# EAGLE schematic science_controller (EAGLE 9.3.0)

## Sheet 1 of 3: MCU / Power
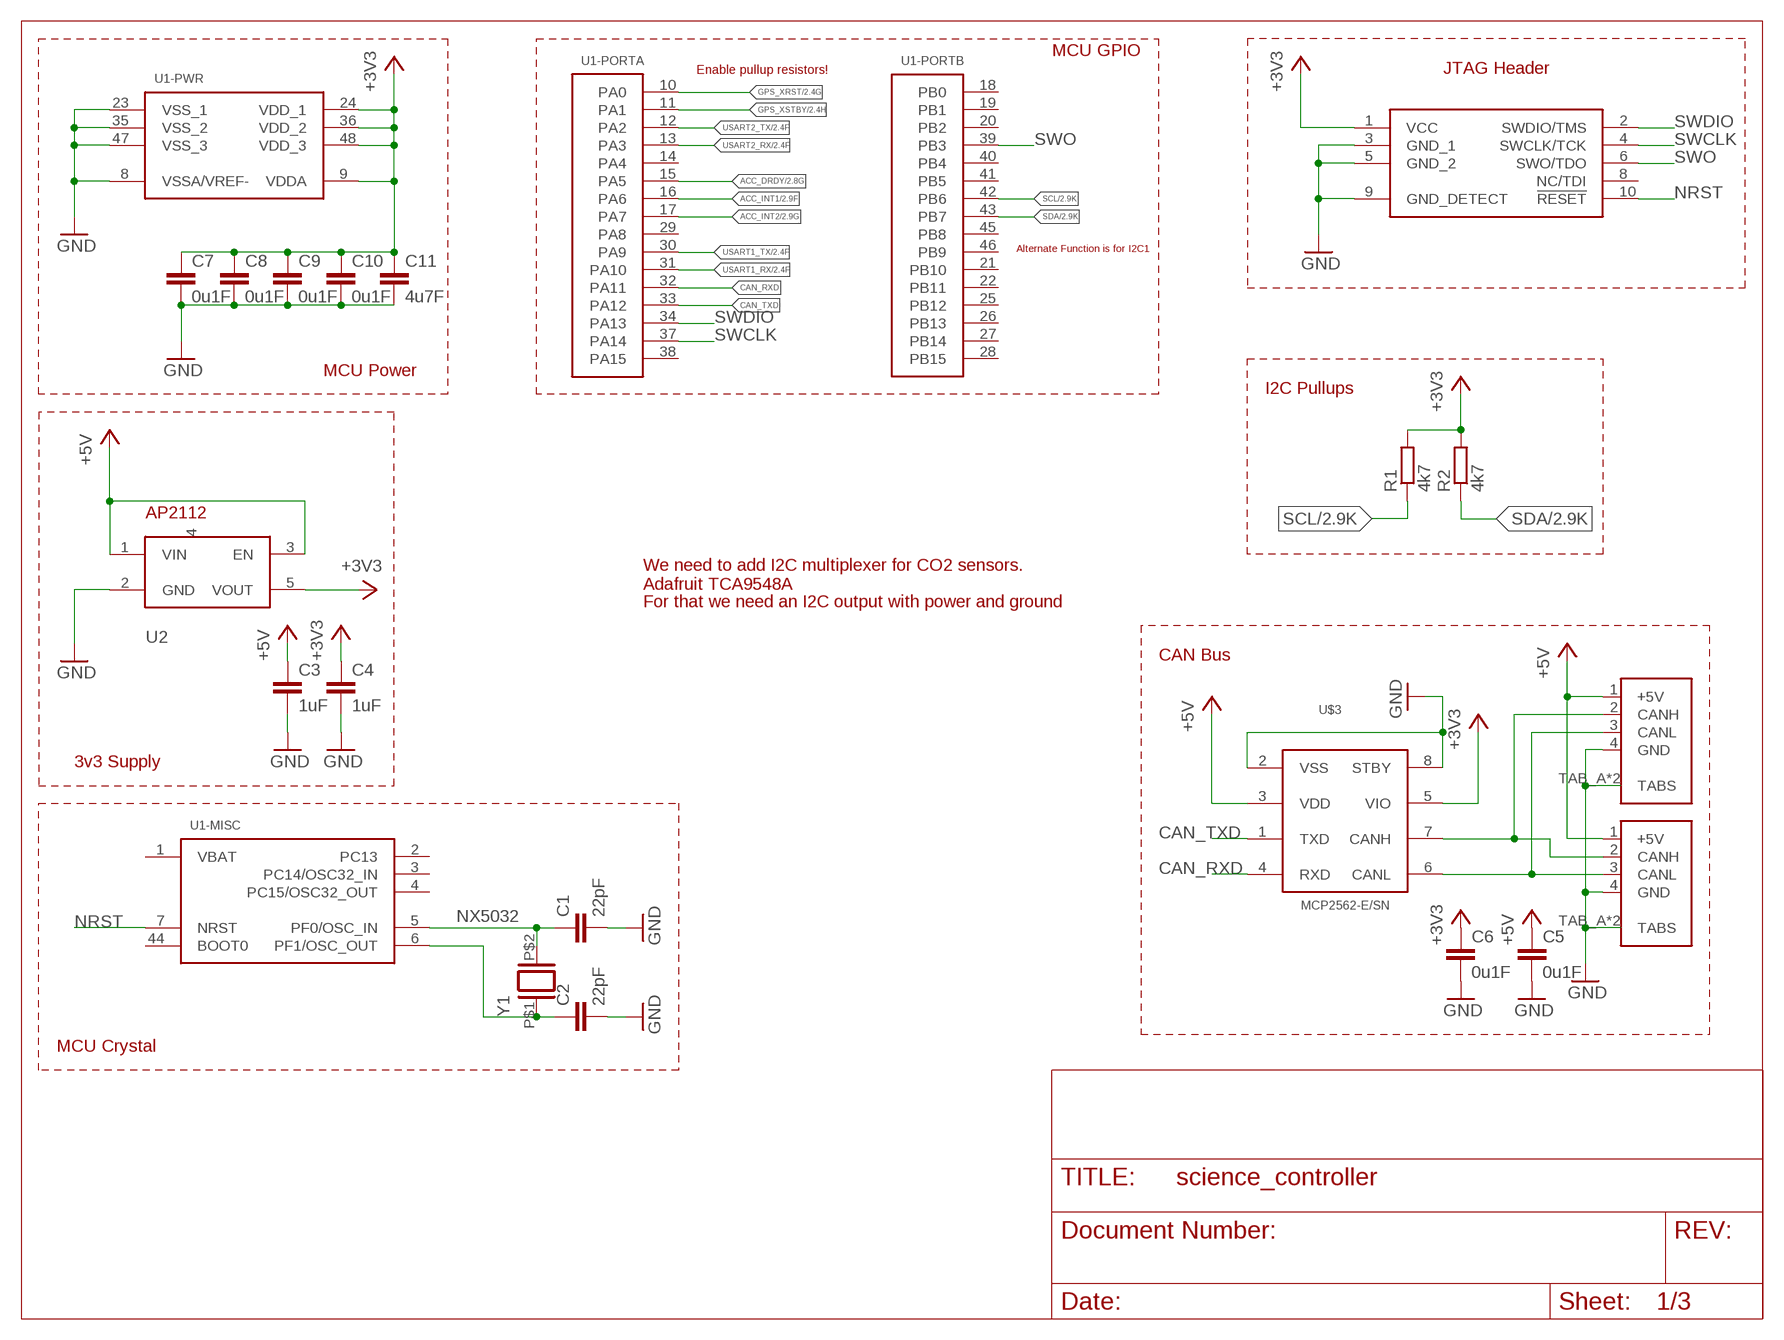
[diagram p0: schematic, sheet 1]

### Parts
C1  22pF  C-EUC0805  [C0805]
C2  22pF  C-EUC0805  [C0805]
C3  1uF  C-EUC0805  [C0805]
C4  1uF  C-EUC0805  [C0805]
C5  0u1F  C-EUC0805  [C0805]
C6  0u1F  C-EUC0805  [C0805]
C7  0u1F  C-EUC0805  [C0805]
C8  0u1F  C-EUC0805  [C0805]
C9  0u1F  C-EUC0805  [C0805]
C10  0u1F  C-EUC0805  [C0805]
C11  4u7F  C-EUC0805  [C0805]
CON1  UAVCAN_MICRO  [SM04B-GHS-TB]
CON2  UAVCAN_MICRO  [SM04B-GHS-TB]
JP1  CORTEX-M-DBG  [FTSH-105-01-F-DV-007]
R1  4k7  R-EU_R0805  [R0805]
R2  4k7  R-EU_R0805  [R0805]
U1  STM32F303CB  [LQFP48]
U2  AP2112K-3.3TRG1  [SOT25]
U$3  MCP2562-E/SN  [SOIC8]
Y1  NX5032  [NX5032]

### Nets
+3V3: C4.1 C6.1 C7.1 C8.1 C9.1 C10.1 C11.1 JP1.1(VCC) R1.2 R2.2 U1.9(-PWR:VDDA) U1.24(-PWR:VDD_1) U1.36(-PWR:VDD_2) U1.48(-PWR:VDD_3) U2.5(VOUT) U$3.5(VIO) ; also sheet 2
+5V: C3.1 C5.1 CON1.1(+5V) CON2.1(+5V) U2.1(VIN) U2.3(EN) U$3.3(VDD) ; also sheet 2,3
ACC_DRDY: U1.15(-PORTA:PA5) ; also sheet 2
ACC_INT1: U1.16(-PORTA:PA6) ; also sheet 2
ACC_INT2: U1.17(-PORTA:PA7) ; also sheet 2
CAN_RXD: U1.32(-PORTA:PA11) U$3.4(RXD)
CAN_TXD: U1.33(-PORTA:PA12) U$3.1(TXD)
GND: C1.2 C2.2 C3.2 C4.2 C5.2 C6.2 C7.2 C8.2 C9.2 C10.2 C11.2 CON1.4(GND) CON1.TAB_A(TABS) CON1.TAB_B(TABS) CON2.4(GND) CON2.TAB_A(TABS) CON2.TAB_B(TABS) JP1.3(GND_1) JP1.5(GND_2) JP1.9(GND_DETECT) U1.8(-PWR:VSSA/VREF-) U1.23(-PWR:VSS_1) U1.35(-PWR:VSS_2) U1.47(-PWR:VSS_3) U2.2(GND) U$3.2(VSS) U$3.8(STBY) ; also sheet 2,3
GPS_XRST: U1.10(-PORTA:PA0) ; also sheet 2
GPS_XSTBY: U1.11(-PORTA:PA1) ; also sheet 2
N$1: C1.1 U1.5(-MISC:PF0/OSC_IN) Y1.P$2
N$2: C2.1 U1.6(-MISC:PF1/OSC_OUT) Y1.P$1
N$3: CON1.2(CANH) CON2.2(CANH) U$3.7(CANH)
N$4: CON1.3(CANL) CON2.3(CANL) U$3.6(CANL)
NRST: JP1.10(!RESET) U1.7(-MISC:NRST)
SCL: R1.1 U1.42(-PORTB:PB6) ; also sheet 2,3
SDA: R2.1 U1.43(-PORTB:PB7) ; also sheet 2,3
SWCLK: JP1.4(SWCLK/TCK) U1.37(-PORTA:PA14)
SWDIO: JP1.2(SWDIO/TMS) U1.34(-PORTA:PA13)
SWO: JP1.6(SWO/TDO) U1.39(-PORTB:PB3)
USART1_RX: U1.31(-PORTA:PA10) ; also sheet 2
USART1_TX: U1.30(-PORTA:PA9) ; also sheet 2
USART2_RX: U1.13(-PORTA:PA3) ; also sheet 2
USART2_TX: U1.12(-PORTA:PA2) ; also sheet 2
Unconnected: JP1.8(NC/TDI) U1.1(-MISC:VBAT) U1.2(-MISC:PC13) U1.3(-MISC:PC14/OSC32_IN) U1.4(-MISC:PC15/OSC32_OUT) U1.14(-PORTA:PA4) U1.18(-PORTB:PB0) U1.19(-PORTB:PB1) U1.20(-PORTB:PB2) U1.21(-PORTB:PB10) U1.22(-PORTB:PB11) U1.25(-PORTB:PB12) U1.26(-PORTB:PB13) U1.27(-PORTB:PB14) U1.28(-PORTB:PB15) U1.29(-PORTA:PA8) U1.38(-PORTA:PA15) U1.40(-PORTB:PB4) U1.41(-PORTB:PB5) U1.44(-MISC:BOOT0) U1.45(-PORTB:PB8) U1.46(-PORTB:PB9) U2.4(NC)

### Notes on the sheet
- MCU GPIO
- Enable pullup resistors! | JTAG Header
- Alternate Function is for I2C1
- MCU Power
- I2C Pullups
- We need to add I2C multiplexer for CO2 sensors.
  Adafruit TCA9548A
- For that we need an I2C output with power and ground
- CAN Bus
- 3v3 Supply
- MCU Crystal

## Sheet 2 of 3: Sensors
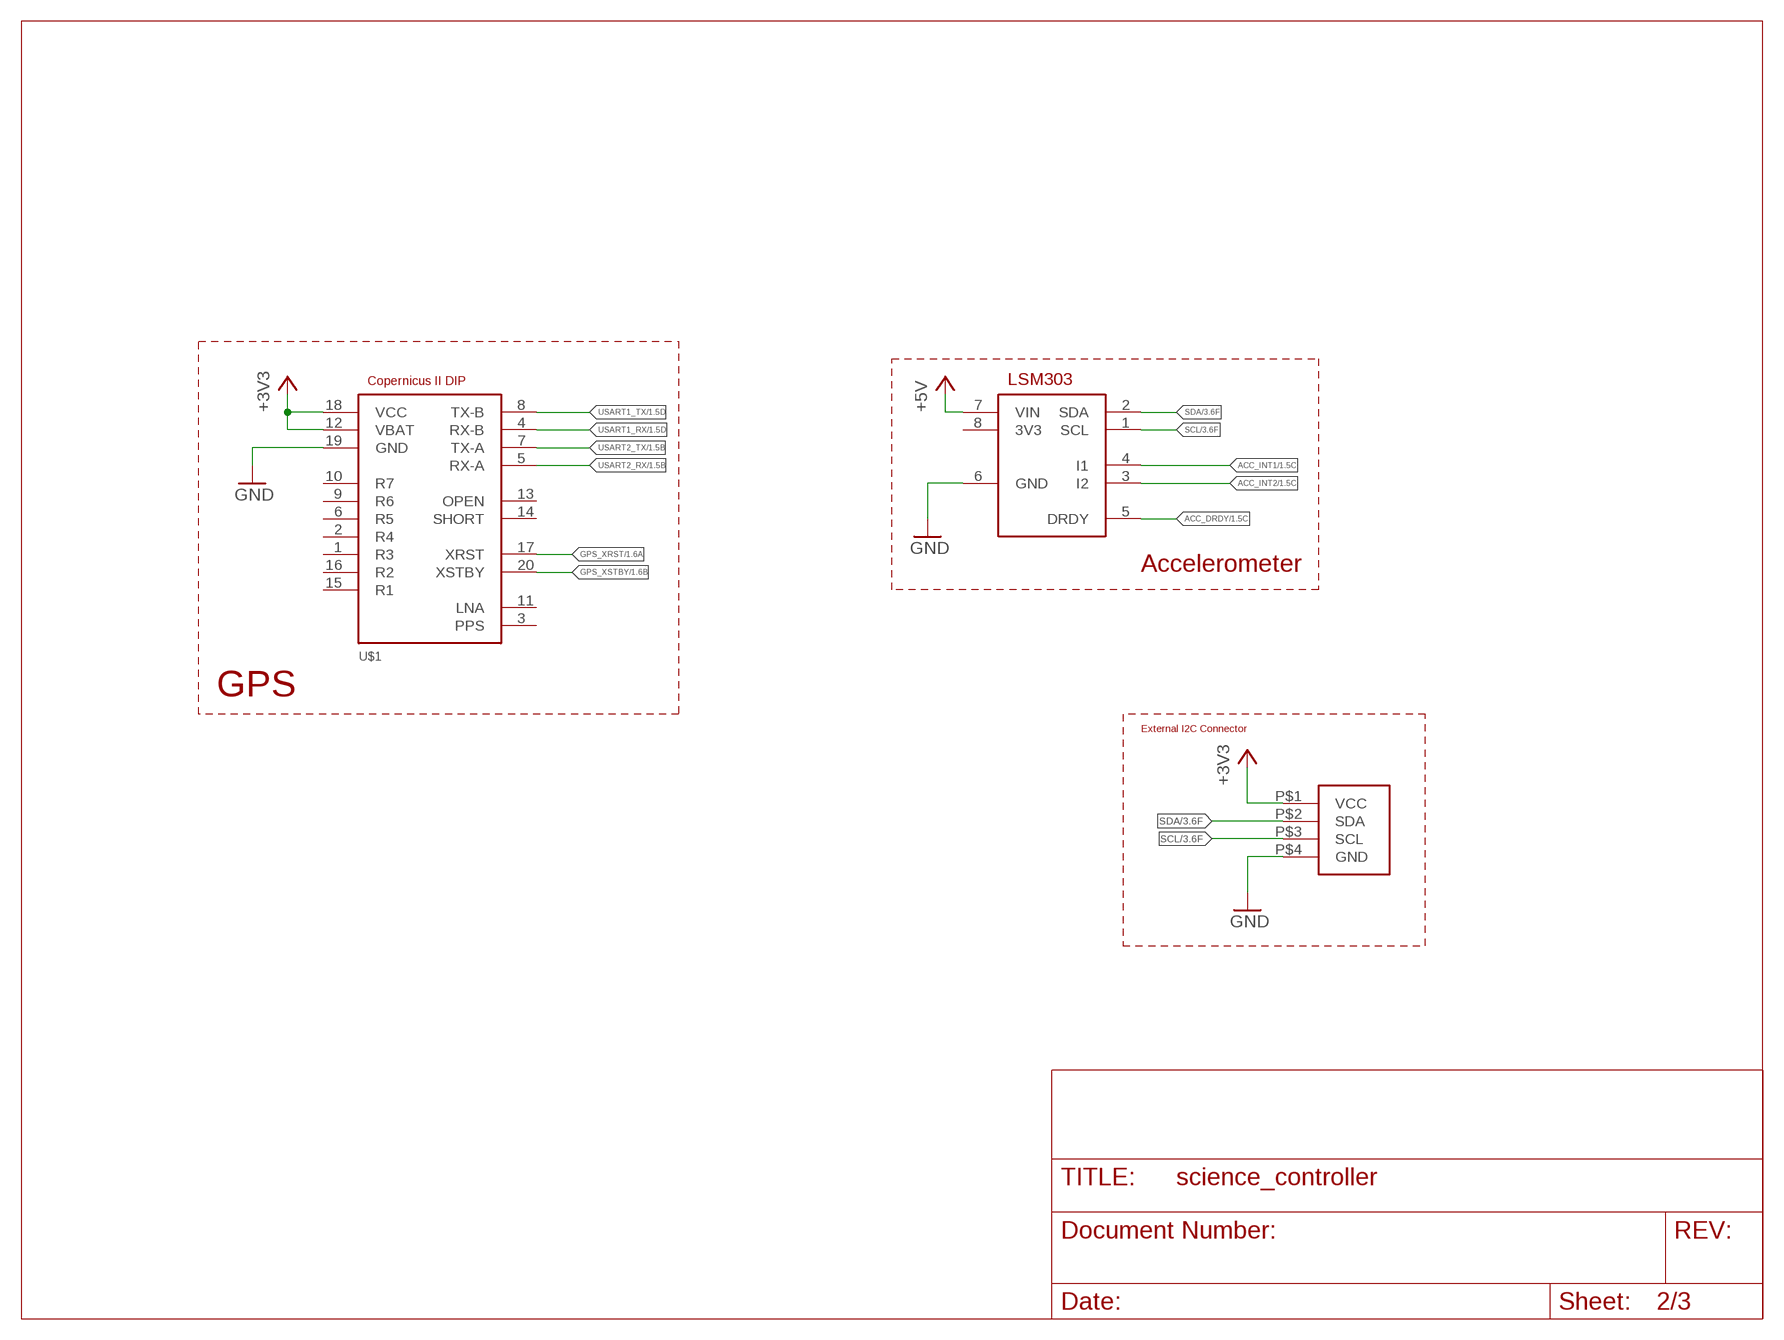
[diagram p1: schematic, sheet 2]

### Parts
P1  I2C-PWR  [TE_5-103669-3]
U$1  COPERN2-DIP  [COPERN2-DIP]
U$2  LSM303-BRKOUT  [1X08]

### Nets
+3V3: P1.P$1(VCC) U$1.12(VBAT) U$1.18(VCC) ; also sheet 1
+5V: U$2.7(VIN) ; also sheet 1,3
ACC_DRDY: U$2.5(DRDY) ; also sheet 1
ACC_INT1: U$2.4(I1) ; also sheet 1
ACC_INT2: U$2.3(I2) ; also sheet 1
GND: P1.P$4(GND) U$1.19(GND) U$2.6(GND) ; also sheet 1,3
GPS_XRST: U$1.17(XRST) ; also sheet 1
GPS_XSTBY: U$1.20(XSTBY) ; also sheet 1
SCL: P1.P$3(SCL) U$2.1(SCL) ; also sheet 1,3
SDA: P1.P$2(SDA) U$2.2(SDA) ; also sheet 1,3
USART1_RX: U$1.4(RX-B) ; also sheet 1
USART1_TX: U$1.8(TX-B) ; also sheet 1
USART2_RX: U$1.5(RX-A) ; also sheet 1
USART2_TX: U$1.7(TX-A) ; also sheet 1
Unconnected: U$1.1(R3) U$1.2(R4) U$1.3(PPS) U$1.6(R5) U$1.9(R6) U$1.10(R7) U$1.11(LNA) U$1.13(OPEN) U$1.14(SHORT) U$1.15(R1) U$1.16(R2) U$2.8(3V3)

### Notes on the sheet
- Accelerometer
- GPS
- External I2C Connector

## Sheet 3 of 3: Servo
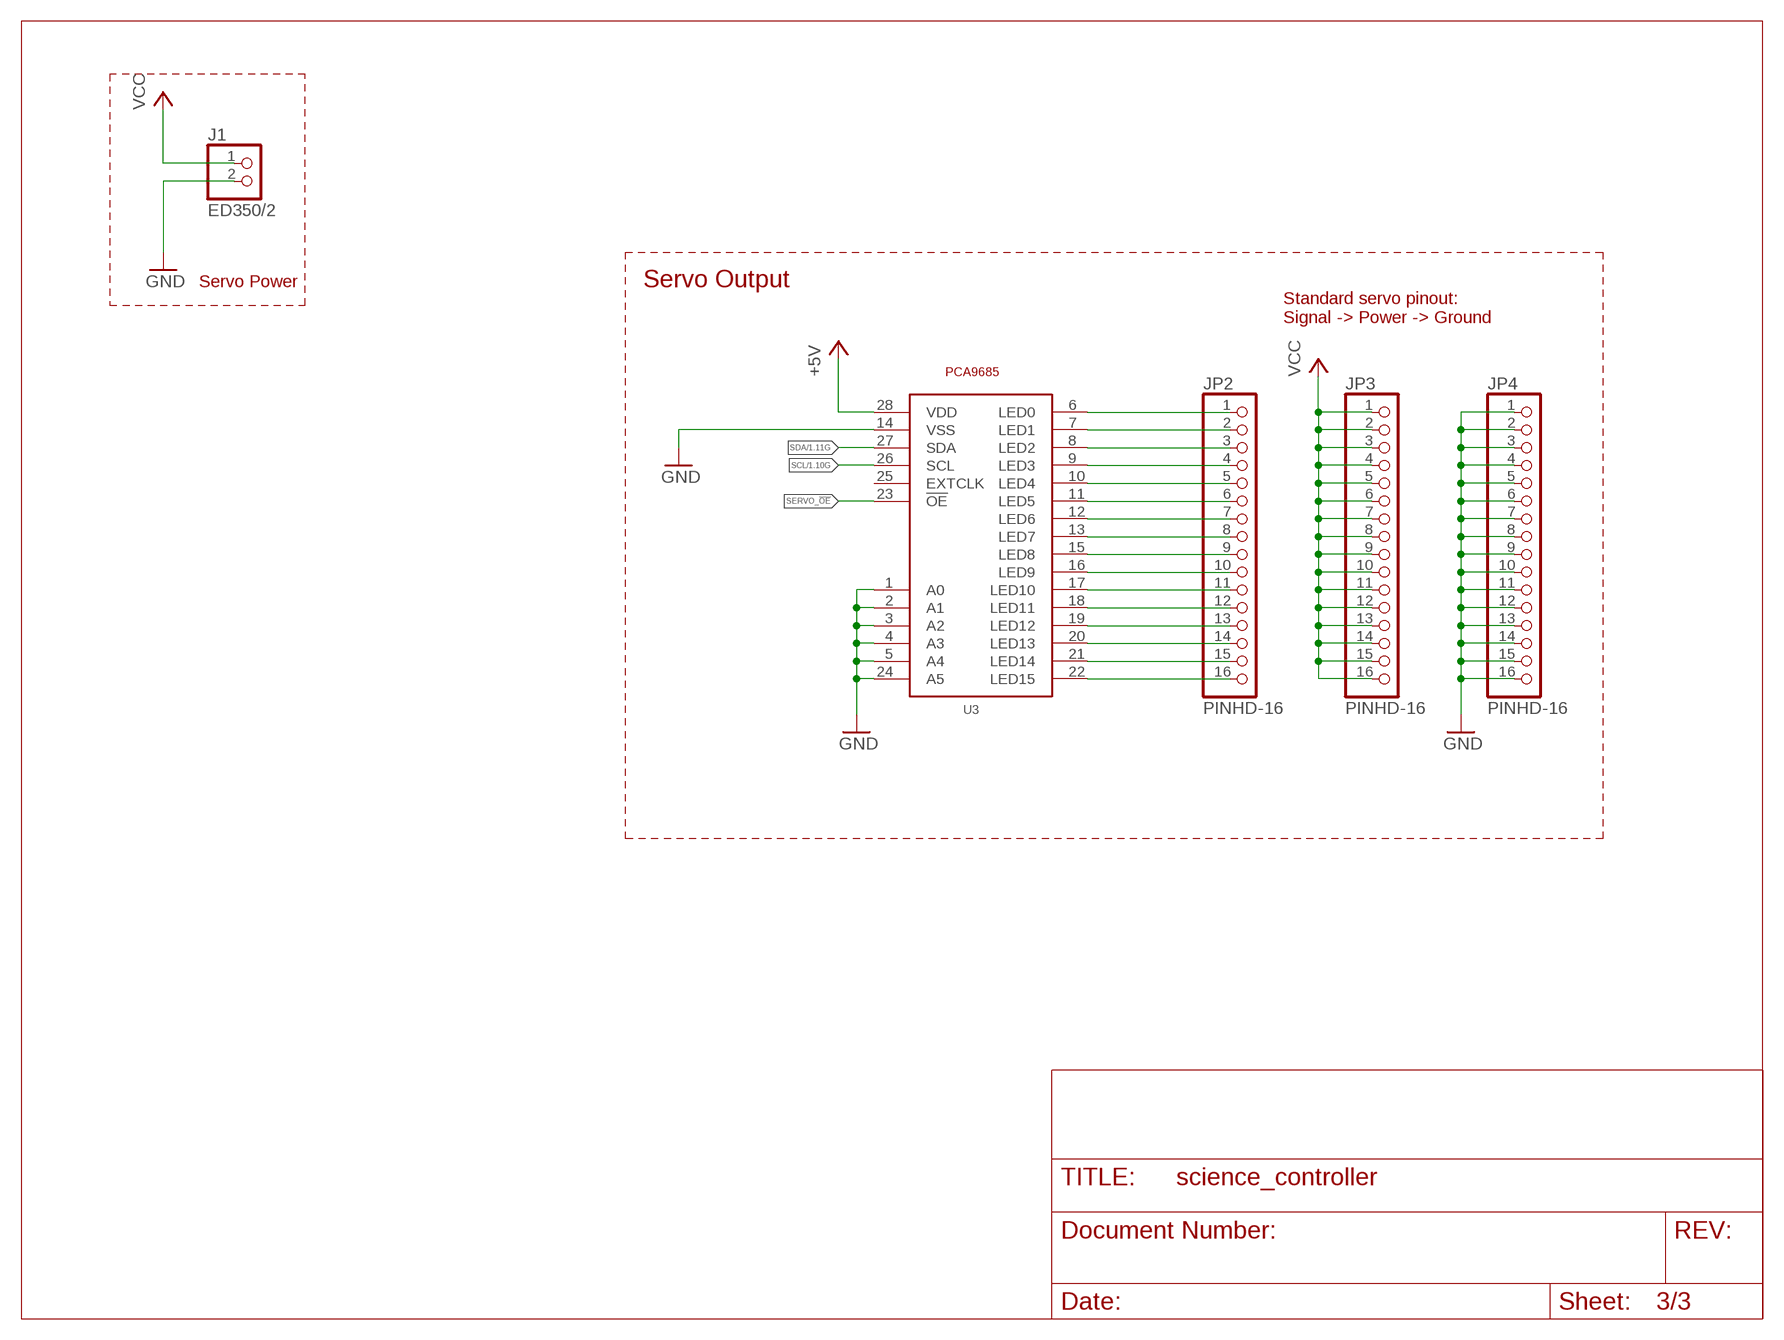
[diagram p2: schematic, sheet 3]

### Parts
J1  ED350/2  [ED350/2]
JP2  PINHD-16  [1X16]
JP3  PINHD-16  [1X16]
JP4  PINHD-16  [1X16]
U3  PCA9685PW  [TSSOP28]

### Nets
+5V: U3.28(VDD) ; also sheet 1,2
GND: J1.2 JP4.1 JP4.2 JP4.3 JP4.4 JP4.5 JP4.6 JP4.7 JP4.8 JP4.9 JP4.10 JP4.11 JP4.12 JP4.13 JP4.14 JP4.15 JP4.16 U3.1(A0) U3.2(A1) U3.3(A2) U3.4(A3) U3.5(A4) U3.14(VSS) U3.24(A5) ; also sheet 1,2
SCL: U3.26(SCL) ; also sheet 1,2
SDA: U3.27(SDA) ; also sheet 1,2
SERVO0: JP2.1 U3.6(LED0)
SERVO1: JP2.2 U3.7(LED1)
SERVO2: JP2.3 U3.8(LED2)
SERVO3: JP2.4 U3.9(LED3)
SERVO4: JP2.5 U3.10(LED4)
SERVO5: JP2.6 U3.11(LED5)
SERVO6: JP2.7 U3.12(LED6)
SERVO7: JP2.8 U3.13(LED7)
SERVO8: JP2.9 U3.15(LED8)
SERVO9: JP2.10 U3.16(LED9)
SERVO10: JP2.11 U3.17(LED10)
SERVO11: JP2.12 U3.18(LED11)
SERVO12: JP2.13 U3.19(LED12)
SERVO13: JP2.14 U3.20(LED13)
SERVO14: JP2.15 U3.21(LED14)
SERVO15: JP2.16 U3.22(LED15)
SERVO_!OE: U3.23(!OE)
VCC: J1.1 JP3.1 JP3.2 JP3.3 JP3.4 JP3.5 JP3.6 JP3.7 JP3.8 JP3.9 JP3.10 JP3.11 JP3.12 JP3.13 JP3.14 JP3.15 JP3.16
Unconnected: U3.25(EXTCLK)

### Notes on the sheet
- Servo Power | Servo Output
- Standard servo pinout:
  Signal -> Power -> Ground

## Library data of the parts
C1-C11 = resistor:C-EU: CAPACITOR, European symbol
CON1 CON2 = SPEAR-general:UAVCAN_MICRO: CAN Bus Standard Connector
J1 = SPEAR-science-controller:ED350/2: 2-pin 5mm Screw Terminal Header
JP1 = SPEAR-general:CORTEX-M-DBG: Cortex-M Debug Header Standard debug/programming header used for programming Cortex parts. Does not include shroud but does have key pin removed.
JP2-JP4 = SPEAR-science-controller:PINHD-16: 16 Pin Single Row Pin Header
P1 = SPEAR-science-controller:I2C-PWR: I2C connector with power.
R1 R2 = resistor:R-EU_: RESISTOR, European symbol
U1 = SPEAR-general:STM32F303CB: STM32F303CBT 32-bit microcontroller in an LQFP48 package - 128Kbytes flash.
U2 = SPEAR-general:AP2112K-3.3TRG1
U3 = SPEAR-science-controller:PCA9685PW
U$1 = SPEAR-science-controller:COPERN2-DIP: Copernicus II - DIP Copernicus II DIP GPS module breakout from SparkFun. Product Page <https://www.sparkfun.com/products/11858> Footrpint isn't entirely accurate. The pins should work though.
U$2 = SPEAR-science-controller:LSM303-BRKOUT: LSM303 Breakout LSM303 Magnetometer+Accelerometer breakout board from Adafruit. Product Page <https://www.adafruit.com/product/1120> Datasheet <https://www.st.com/resource/en/datasheet/DM00027543.pdf>
U$3 = SPEAR-general:MCP2562-E/SN: CAN Bus Transciever
Y1 = SPEAR-general:NX5032